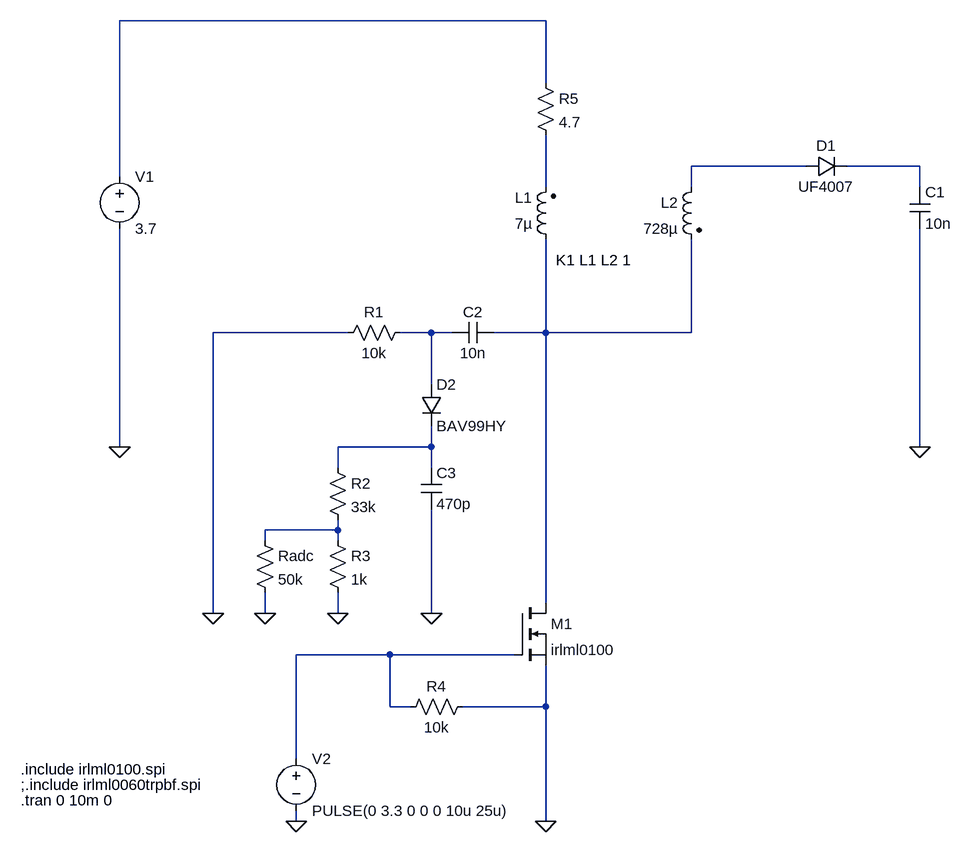
[diagram p0: schematic Flyback_TDK.asc]
Flyback_TDK.asc, the LTspice schematic file:
Version 4
SHEET 1 1444 1192
WIRE 160 -144 -496 -144
WIRE 160 -48 160 -144
WIRE 560 80 384 80
WIRE 736 80 624 80
WIRE -496 96 -496 -144
WIRE 160 112 160 32
WIRE 384 112 384 80
WIRE 736 112 736 80
WIRE -144 336 -352 336
WIRE -16 336 -64 336
WIRE 16 336 -16 336
WIRE 160 336 160 192
WIRE 160 336 80 336
WIRE 384 336 384 192
WIRE 384 336 160 336
WIRE -16 416 -16 336
WIRE -496 512 -496 176
WIRE -16 512 -16 480
WIRE -16 512 -160 512
WIRE 736 512 736 176
WIRE -160 544 -160 512
WIRE -16 544 -16 512
WIRE -160 640 -160 624
WIRE -160 640 -272 640
WIRE -272 656 -272 640
WIRE -160 656 -160 640
WIRE 160 752 160 336
WIRE -352 768 -352 336
WIRE -272 768 -272 736
WIRE -160 768 -160 736
WIRE -16 768 -16 608
WIRE -80 832 -224 832
WIRE 112 832 -80 832
WIRE -80 912 -80 832
WIRE -48 912 -80 912
WIRE 160 912 160 848
WIRE 160 912 32 912
WIRE -224 992 -224 832
WIRE -224 1088 -224 1072
WIRE 160 1088 160 912
FLAG 160 1088 0
FLAG 736 512 0
FLAG -496 512 0
FLAG -224 1088 0
FLAG -160 768 0
FLAG -16 768 0
FLAG -352 768 0
FLAG -272 768 0
SYMBOL ind2 176 208 R180
WINDOW 0 36 80 Left 2
WINDOW 3 36 40 Left 2
SYMATTR InstName L1
SYMATTR Value 7µ
SYMATTR Type ind
SYMATTR SpiceLine Rser=0.5
SYMBOL ind2 400 96 M0
SYMATTR InstName L2
SYMATTR Value 728µ
SYMATTR Type ind
SYMATTR SpiceLine Rser=60
SYMBOL diode 560 96 R270
WINDOW 0 32 32 VTop 2
WINDOW 3 0 32 VBottom 2
SYMATTR InstName D1
SYMATTR Value UF4007
SYMBOL cap 720 112 R0
SYMATTR InstName C1
SYMATTR Value 10n
SYMBOL voltage -496 80 R0
WINDOW 123 0 0 Left 0
WINDOW 39 0 0 Left 0
SYMATTR InstName V1
SYMATTR Value 3.7
SYMBOL voltage -224 976 R0
WINDOW 123 0 0 Left 0
WINDOW 39 0 0 Left 0
SYMATTR InstName V2
SYMATTR Value PULSE(0 3.3 0 0 0 10u 25u)
SYMBOL nmos 112 752 R0
SYMATTR InstName M1
SYMATTR Value irlml0100
SYMATTR Prefix X
SYMBOL cap 80 320 R90
WINDOW 0 0 32 VBottom 2
WINDOW 3 32 32 VTop 2
SYMATTR InstName C2
SYMATTR Value 10n
SYMBOL diode -32 416 R0
SYMATTR InstName D2
SYMATTR Value BAV99HY
SYMBOL cap -32 544 R0
SYMATTR InstName C3
SYMATTR Value 470p
SYMBOL res -176 528 R0
SYMATTR InstName R2
SYMATTR Value 33k
SYMBOL res -176 640 R0
SYMATTR InstName R3
SYMATTR Value 1k
SYMBOL res -288 640 R0
SYMATTR InstName Radc
SYMATTR Value 50k
SYMBOL res 48 896 R90
WINDOW 0 0 56 VBottom 2
WINDOW 3 32 56 VTop 2
SYMATTR InstName R4
SYMATTR Value 10k
SYMBOL res -48 320 R90
WINDOW 0 0 56 VBottom 2
WINDOW 3 32 56 VTop 2
SYMATTR InstName R1
SYMATTR Value 10k
SYMBOL res 144 -64 R0
SYMATTR InstName R5
SYMATTR Value 4.7
TEXT 176 224 Left 2 !K1 L1 L2 1
TEXT -648 1056 Left 2 !.tran 0 10m 0
TEXT -648 1032 Left 2 !;.include irlml0060trpbf.spi
TEXT -648 1008 Left 2 !.include irlml0100.spi

The netlist it stands for:
* Flyback_TDK.asc
L1 N006 N004 7µ Rser=0.5
L2 N002 N006 728µ Rser=60
D1 N002 N003 UF4007
C1 N003 0 10n
V1 N001 0 3.7
V2 N009 0 PULSE(0 3.3 0 0 0 10u 25u)
XM1 N006 N009 0 irlml0100  ; pins D G S
C2 N006 N005 10n
D2 N005 N007 BAV99HY
C3 N007 0 470p
R2 N007 N008 33k
R3 N008 0 1k
Radc N008 0 50k
R4 0 N009 10k
R1 N005 0 10k
R5 N001 N004 4.7
.model D D
.lib standard.dio
K1 L1 L2 1
.tran 0 10m 0
;.include irlml0060trpbf.spi
.include irlml0100.spi
.backanno
.end